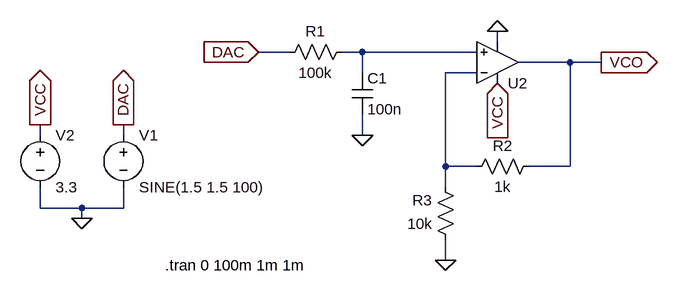
[diagram p0: schematic _VCO_amp_PCB.asc]
_VCO_amp_PCB.asc, the LTspice schematic file:
Version 4
SHEET 1 880 680
WIRE 432 -64 432 -80
WIRE 112 -48 64 -48
WIRE 224 -48 192 -48
WIRE 400 -48 224 -48
WIRE 544 -32 464 -32
WIRE 592 -32 544 -32
WIRE 224 -16 224 -48
WIRE 400 -16 352 -16
WIRE -272 80 -272 64
WIRE -144 80 -144 64
WIRE 224 80 224 48
WIRE 352 128 352 -16
WIRE 400 128 352 128
WIRE 544 128 544 -32
WIRE 544 128 480 128
WIRE 352 160 352 128
WIRE -272 192 -272 160
WIRE -208 192 -272 192
WIRE -144 192 -144 160
WIRE -144 192 -208 192
WIRE -208 208 -208 192
WIRE 352 272 352 240
FLAG 224 80 0
FLAG 352 272 0
FLAG -272 64 VCC
IOPIN -272 64 Out
FLAG 432 0 VCC
IOPIN 432 0 In
FLAG 432 -80 0
FLAG 592 -32 VCO
IOPIN 592 -32 Out
FLAG -208 208 0
FLAG -144 64 DAC
IOPIN -144 64 Out
FLAG 64 -48 DAC
IOPIN 64 -48 In
SYMBOL voltage -144 64 R0
WINDOW 123 0 0 Left 0
WINDOW 39 0 0 Left 0
SYMATTR InstName V1
SYMATTR Value SINE(1.5 1.5 100)
SYMBOL res 208 -64 R90
WINDOW 0 0 56 VBottom 2
WINDOW 3 32 56 VTop 2
SYMATTR InstName R1
SYMATTR Value 100k
SYMBOL cap 208 -16 R0
SYMATTR InstName C1
SYMATTR Value 100n
SYMBOL res 496 112 R90
WINDOW 0 0 56 VBottom 2
WINDOW 3 32 56 VTop 2
SYMATTR InstName R2
SYMATTR Value 1k
SYMBOL res 368 256 R180
WINDOW 0 36 76 Left 2
WINDOW 3 36 40 Left 2
SYMATTR InstName R3
SYMATTR Value 10k
SYMBOL voltage -272 64 R0
WINDOW 123 0 0 Left 0
WINDOW 39 0 0 Left 0
SYMATTR InstName V2
SYMATTR Value 3.3
SYMBOL Opamps\\UniversalOpamp2 432 -32 M180
SYMATTR InstName U2
TEXT -80 280 Left 2 !.tran 0 100m 1m 1m

The netlist it stands for:
* _VCO_amp_PCB.asc
V1 DAC 0 SINE(1.5 1.5 100)
R1 N001 DAC 100k
C1 N001 0 100n
R2 VCO N002 1k
R3 0 N002 10k
V2 VCC 0 3.3
XU2 N001 N002 VCC 0 VCO level.2 Avol=1Meg GBW=10Meg Slew=10Meg ilimit=25m rail=0 Vos=0 phimargin=45 en=0 enk=0 in=0 ink=0 Rin=500Meg  ; pins IN+ IN- V+ V- OUT
.tran 0 100m 1m 1m
.lib UniversalOpamps2.sub
.backanno
.end